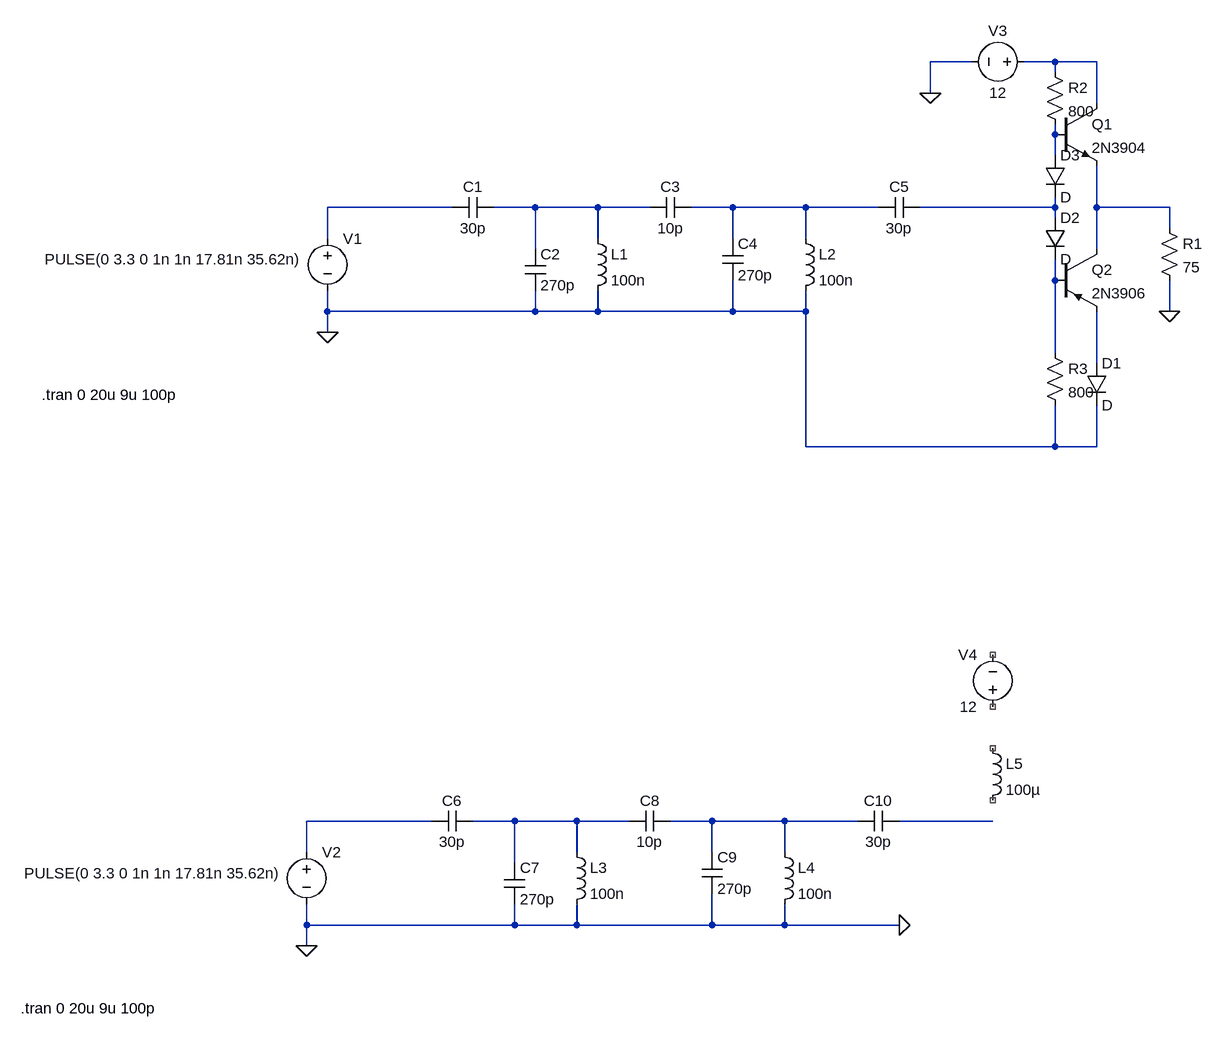
[diagram p0: schematic 10_meter_amplifier_filter.asc]
10_meter_amplifier_filter.asc, the LTspice schematic file:
Version 4
SHEET 1 1320 1380
WIRE 960 -160 896 -160
WIRE 1088 -160 1040 -160
WIRE 1152 -160 1088 -160
WIRE 1088 -144 1088 -160
WIRE 896 -112 896 -160
WIRE 1152 -96 1152 -160
WIRE 1088 -48 1088 -64
WIRE 1088 -16 1088 -48
WIRE 160 64 -32 64
WIRE 288 64 224 64
WIRE 384 64 288 64
WIRE 464 64 384 64
WIRE 592 64 528 64
WIRE 704 64 592 64
WIRE 816 64 704 64
WIRE 1088 64 1088 48
WIRE 1088 64 880 64
WIRE 1152 64 1152 0
WIRE 1264 64 1152 64
WIRE 1088 80 1088 64
WIRE 1264 96 1264 64
WIRE -32 112 -32 64
WIRE 384 112 384 64
WIRE 592 112 592 64
WIRE 704 112 704 64
WIRE 288 128 288 64
WIRE 1152 128 1152 64
WIRE 1088 176 1088 144
WIRE -32 224 -32 192
WIRE 288 224 288 192
WIRE 288 224 -32 224
WIRE 384 224 384 192
WIRE 384 224 288 224
WIRE 592 224 592 176
WIRE 592 224 384 224
WIRE 704 224 704 192
WIRE 704 224 592 224
WIRE 1264 224 1264 176
WIRE -32 256 -32 224
WIRE 1088 288 1088 176
WIRE 1152 304 1152 224
WIRE 704 432 704 224
WIRE 1088 432 1088 368
WIRE 1088 432 704 432
WIRE 1152 432 1152 368
WIRE 1152 432 1088 432
WIRE 128 1008 -64 1008
WIRE 256 1008 192 1008
WIRE 352 1008 256 1008
WIRE 432 1008 352 1008
WIRE 560 1008 496 1008
WIRE 672 1008 560 1008
WIRE 784 1008 672 1008
WIRE 992 1008 848 1008
WIRE -64 1056 -64 1008
WIRE 352 1056 352 1008
WIRE 560 1056 560 1008
WIRE 672 1056 672 1008
WIRE 256 1072 256 1008
WIRE -64 1168 -64 1136
WIRE 256 1168 256 1136
WIRE 256 1168 -64 1168
WIRE 352 1168 352 1136
WIRE 352 1168 256 1168
WIRE 560 1168 560 1120
WIRE 560 1168 352 1168
WIRE 672 1168 672 1136
WIRE 672 1168 560 1168
WIRE 848 1168 672 1168
WIRE -64 1200 -64 1168
FLAG -32 256 0
FLAG 896 -112 0
FLAG 1264 224 0
FLAG -64 1200 0
FLAG 848 1168 0
SYMBOL cap 224 48 R90
WINDOW 0 0 32 VBottom 2
WINDOW 3 32 32 VTop 2
SYMATTR InstName C1
SYMATTR Value 30p
SYMBOL cap 272 128 R0
SYMATTR InstName C2
SYMATTR Value 270p
SYMBOL ind 368 96 R0
SYMATTR InstName L1
SYMATTR Value 100n
SYMBOL cap 528 48 R90
WINDOW 0 0 32 VBottom 2
WINDOW 3 32 32 VTop 2
SYMATTR InstName C3
SYMATTR Value 10p
SYMBOL cap 576 112 R0
SYMATTR InstName C4
SYMATTR Value 270p
SYMBOL ind 688 96 R0
SYMATTR InstName L2
SYMATTR Value 100n
SYMBOL cap 880 48 R90
WINDOW 0 0 32 VBottom 2
WINDOW 3 32 32 VTop 2
SYMATTR InstName C5
SYMATTR Value 30p
SYMBOL voltage -32 96 R0
WINDOW 3 -435 48 Left 2
WINDOW 123 0 0 Left 0
WINDOW 39 0 0 Left 0
SYMATTR Value PULSE(0 3.3 0 1n 1n 17.81n 35.62n)
SYMATTR InstName V1
SYMBOL npn 1088 -96 R0
SYMATTR InstName Q1
SYMATTR Value 2N3904
SYMBOL pnp 1088 128 R0
SYMATTR InstName Q2
SYMATTR Value 2N3906
SYMBOL res 1248 80 R0
SYMATTR InstName R1
SYMATTR Value 75
SYMBOL voltage 1056 -160 R90
WINDOW 0 -32 56 VBottom 2
WINDOW 3 32 56 VTop 2
WINDOW 123 0 0 Left 0
WINDOW 39 0 0 Left 0
SYMATTR InstName V3
SYMATTR Value 12
SYMBOL diode 1136 304 R0
SYMATTR InstName D1
SYMBOL diode 1072 80 R0
SYMATTR InstName D2
SYMBOL diode 1072 -16 R0
SYMATTR InstName D3
SYMBOL res 1072 -160 R0
SYMATTR InstName R2
SYMATTR Value 800
SYMBOL res 1072 272 R0
SYMATTR InstName R3
SYMATTR Value 800
SYMBOL cap 192 992 R90
WINDOW 0 0 32 VBottom 2
WINDOW 3 32 32 VTop 2
SYMATTR InstName C6
SYMATTR Value 30p
SYMBOL cap 240 1072 R0
SYMATTR InstName C7
SYMATTR Value 270p
SYMBOL ind 336 1040 R0
SYMATTR InstName L3
SYMATTR Value 100n
SYMBOL cap 496 992 R90
WINDOW 0 0 32 VBottom 2
WINDOW 3 32 32 VTop 2
SYMATTR InstName C8
SYMATTR Value 10p
SYMBOL cap 544 1056 R0
SYMATTR InstName C9
SYMATTR Value 270p
SYMBOL ind 656 1040 R0
SYMATTR InstName L4
SYMATTR Value 100n
SYMBOL cap 848 992 R90
WINDOW 0 0 32 VBottom 2
WINDOW 3 32 32 VTop 2
SYMATTR InstName C10
SYMATTR Value 30p
SYMBOL voltage -64 1040 R0
WINDOW 3 -435 48 Left 2
WINDOW 123 0 0 Left 0
WINDOW 39 0 0 Left 0
SYMATTR Value PULSE(0 3.3 0 1n 1n 17.81n 35.62n)
SYMATTR InstName V2
SYMBOL ind 976 880 R0
SYMATTR InstName L5
SYMATTR Value 100µ
SYMBOL voltage 992 848 R180
WINDOW 0 24 96 Left 2
WINDOW 3 24 16 Left 2
WINDOW 123 0 0 Left 0
WINDOW 39 0 0 Left 0
SYMATTR InstName V4
SYMATTR Value 12
TEXT -472 352 Left 2 !.tran 0 20u 9u 100p
TEXT -504 1296 Left 2 !.tran 0 20u 9u 100p

The netlist it stands for:
* 10_meter_amplifier_filter.asc
C1 N004 N003 30p
C2 N004 0 270p
L1 N004 0 100n
C3 N005 N004 10p
C4 N005 0 270p
L2 N005 0 100n
C5 N006 N005 30p
V1 N003 0 PULSE(0 3.3 0 1n 1n 17.81n 35.62n)
Q1 N001 N002 N007 0 2N3904
Q2 N007 N008 N009 0 2N3906
R1 N007 0 75
V3 N001 0 12
D1 N009 0 D
D2 N006 N008 D
D3 N002 N006 D
R2 N001 N002 800
R3 N008 0 800
C6 N011 N010 30p
C7 N011 0 270p
L3 N011 0 100n
C8 N012 N011 10p
C9 N012 0 270p
L4 N012 0 100n
C10 N013 N012 30p
V2 N010 0 PULSE(0 3.3 0 1n 1n 17.81n 35.62n)
L5 NC_01 NC_02 100µ
V4 NC_03 NC_04 12
.model D D
.lib standard.dio
.model NPN NPN
.model PNP PNP
.lib standard.bjt
.tran 0 20u 9u 100p
.tran 0 20u 9u 100p
.backanno
.end